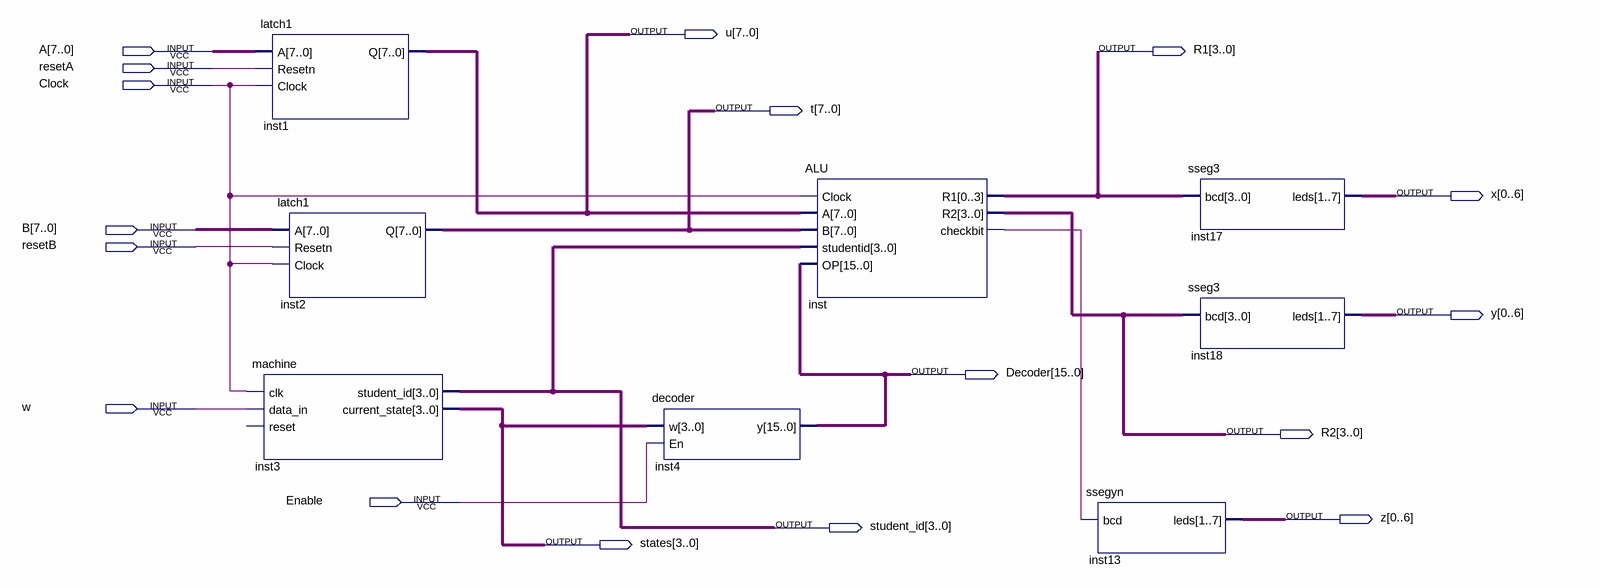
[diagram p0: schematic sheet]
// Quartus schematic Lab6block.bdf as structural Verilog: 8 symbols, 17 pins
module Lab6block (
  input  [7:0] A,
  input  resetA,
  input  Clock,
  input  [7:0] B,
  input  resetB,
  input  w,
  input  Enable,
  output [7:0] u,
  output [3:0] R1,
  output [7:0] t,
  output [0:6] x,
  output [0:6] y,
  output [15:0] Decoder,
  output [3:0] R2,
  output [0:6] z,
  output [3:0] student_id,
  output [3:0] states
);

  wire inst_checkbit;

  latch1 inst1 (.A(A), .Resetn(resetA), .Clock(Clock), .Q(u));
  latch1 inst2 (.A(B), .Resetn(resetB), .Clock(Clock), .Q(t));
  machine inst3 (.clk(Clock), .data_in(w), .student_id(student_id), .current_state(states));  // open: reset
  decoder inst4 (.w(states), .En(Enable), .y(Decoder));
  ALU inst (
    .Clock(Clock), .A(u), .B(t), .studentid(student_id), .OP(Decoder), .R1(R1), .R2(R2),
    .checkbit(inst_checkbit));
  ssegyn inst13 (.bcd(inst_checkbit), .leds(z));
  sseg3 inst17 (.bcd(R1), .leds(x));
  sseg3 inst18 (.bcd(R2), .leds(y));
endmodule
